# EasyEDA Pro project DemultiplexerLibrary.eprj

# Schematic 1-to-16
Create Date: 2023-07-29; Page Name: P1; Project Name: DemultiplexerLibrary; Schematic Name: 1-to-16; Update Date: 2023-07-29; Company: EasyEDA.com; Drawed: EasyEDA Pro; Page Size: A4; Part Number: JLCPCB-002; Reviewed: EasyEDA Pro; Version: V0.1
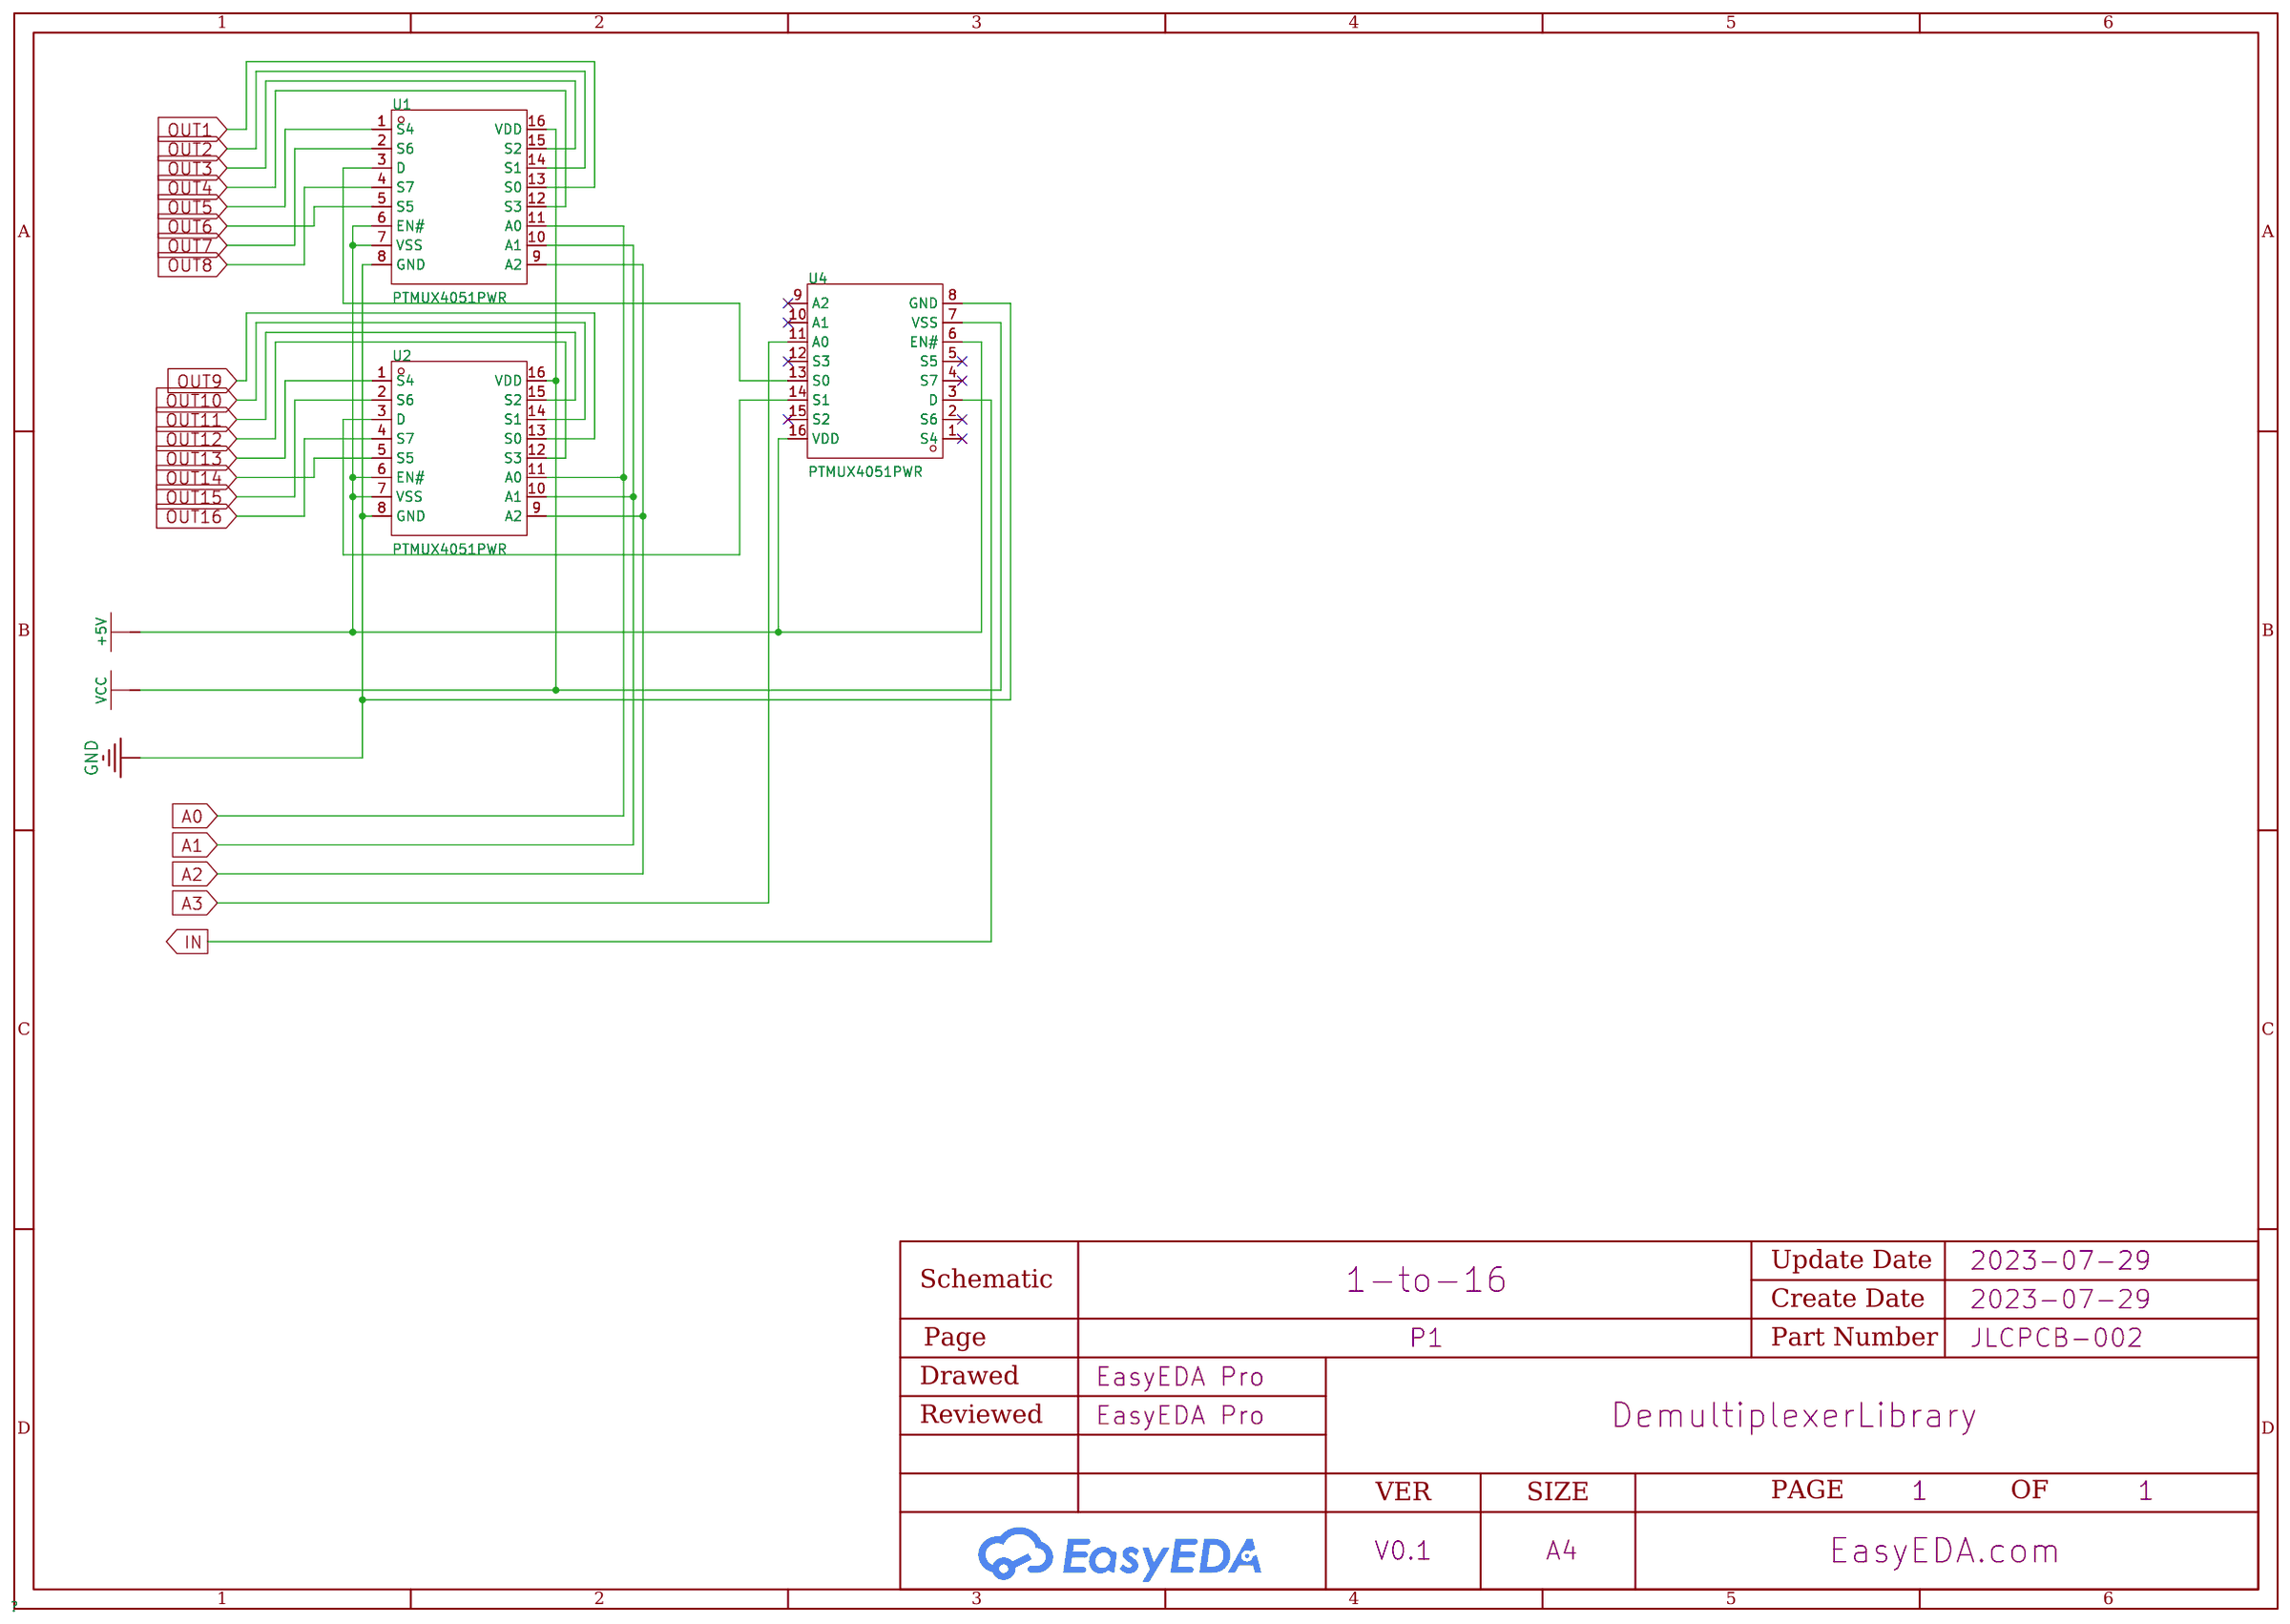
[diagram p0: schematic sheet]

## Parts
U1  PTMUX4051PWR  [TSSOP-16_L5.0-W4.4-P0.65-LS6.4-BL]
U2  PTMUX4051PWR  [TSSOP-16_L5.0-W4.4-P0.65-LS6.4-BL]
U4  PTMUX4051PWR  [TSSOP-16_L5.0-W4.4-P0.65-LS6.4-BL]

## Library data of the parts
U1 U2 U4 = PTMUX4051PWR: Supplier Part: C3033241; Manufacturer: TI(德州仪器); Supplier Footprint: TSSOP(PW); JLCPCB Part Class: Extended Part; Supplier: LCSC

## Nets
+5V: U1.6(EN#) U1.7(VSS) U2.6(EN#) U2.7(VSS) U4.6(EN#) U4.16(VDD)
GND: U1.8(GND) U2.8(GND) U4.8(GND)
VCC: U1.16(VDD) U2.16(VDD) U4.7(VSS)
A0: U1.11(A0) U2.11(A0)
A1: U1.10(A1) U2.10(A1)
A2: U1.9(A2) U2.9(A2)
A3: U4.11(A0)
IN: U4.3(D)
OUT1: U1.13(S0)
OUT2: U1.14(S1)
OUT3: U1.15(S2)
OUT4: U1.12(S3)
OUT5: U1.1(S4)
OUT6: U1.5(S5)
OUT7: U1.2(S6)
OUT8: U1.4(S7)
OUT9: U2.13(S0)
OUT10: U2.14(S1)
OUT11: U2.15(S2)
OUT12: U2.12(S3)
OUT13: U2.1(S4)
OUT14: U2.5(S5)
OUT15: U2.2(S6)
OUT16: U2.4(S7)
Net-(U1-3): U1.3(D) U4.13(S0)
Net-(U2-3): U2.3(D) U4.14(S1)

Not connected (* = marked no-connect by the designer): U4 1(S4)* 2(S6)* 4(S7)* 5(S5)* 9(A2)* 10(A1)* 12(S3)* 15(S2)*

# Schematic 1-to-32
Create Date: 2023-07-29; Page Name: P1; Project Name: DemultiplexerLibrary; Schematic Name: 1-to-32; Update Date: 2023-07-29; Company: EasyEDA.com; Drawed: EasyEDA Pro; Page Size: A4; Part Number: JLCPCB-002; Reviewed: EasyEDA Pro; Version: V0.1
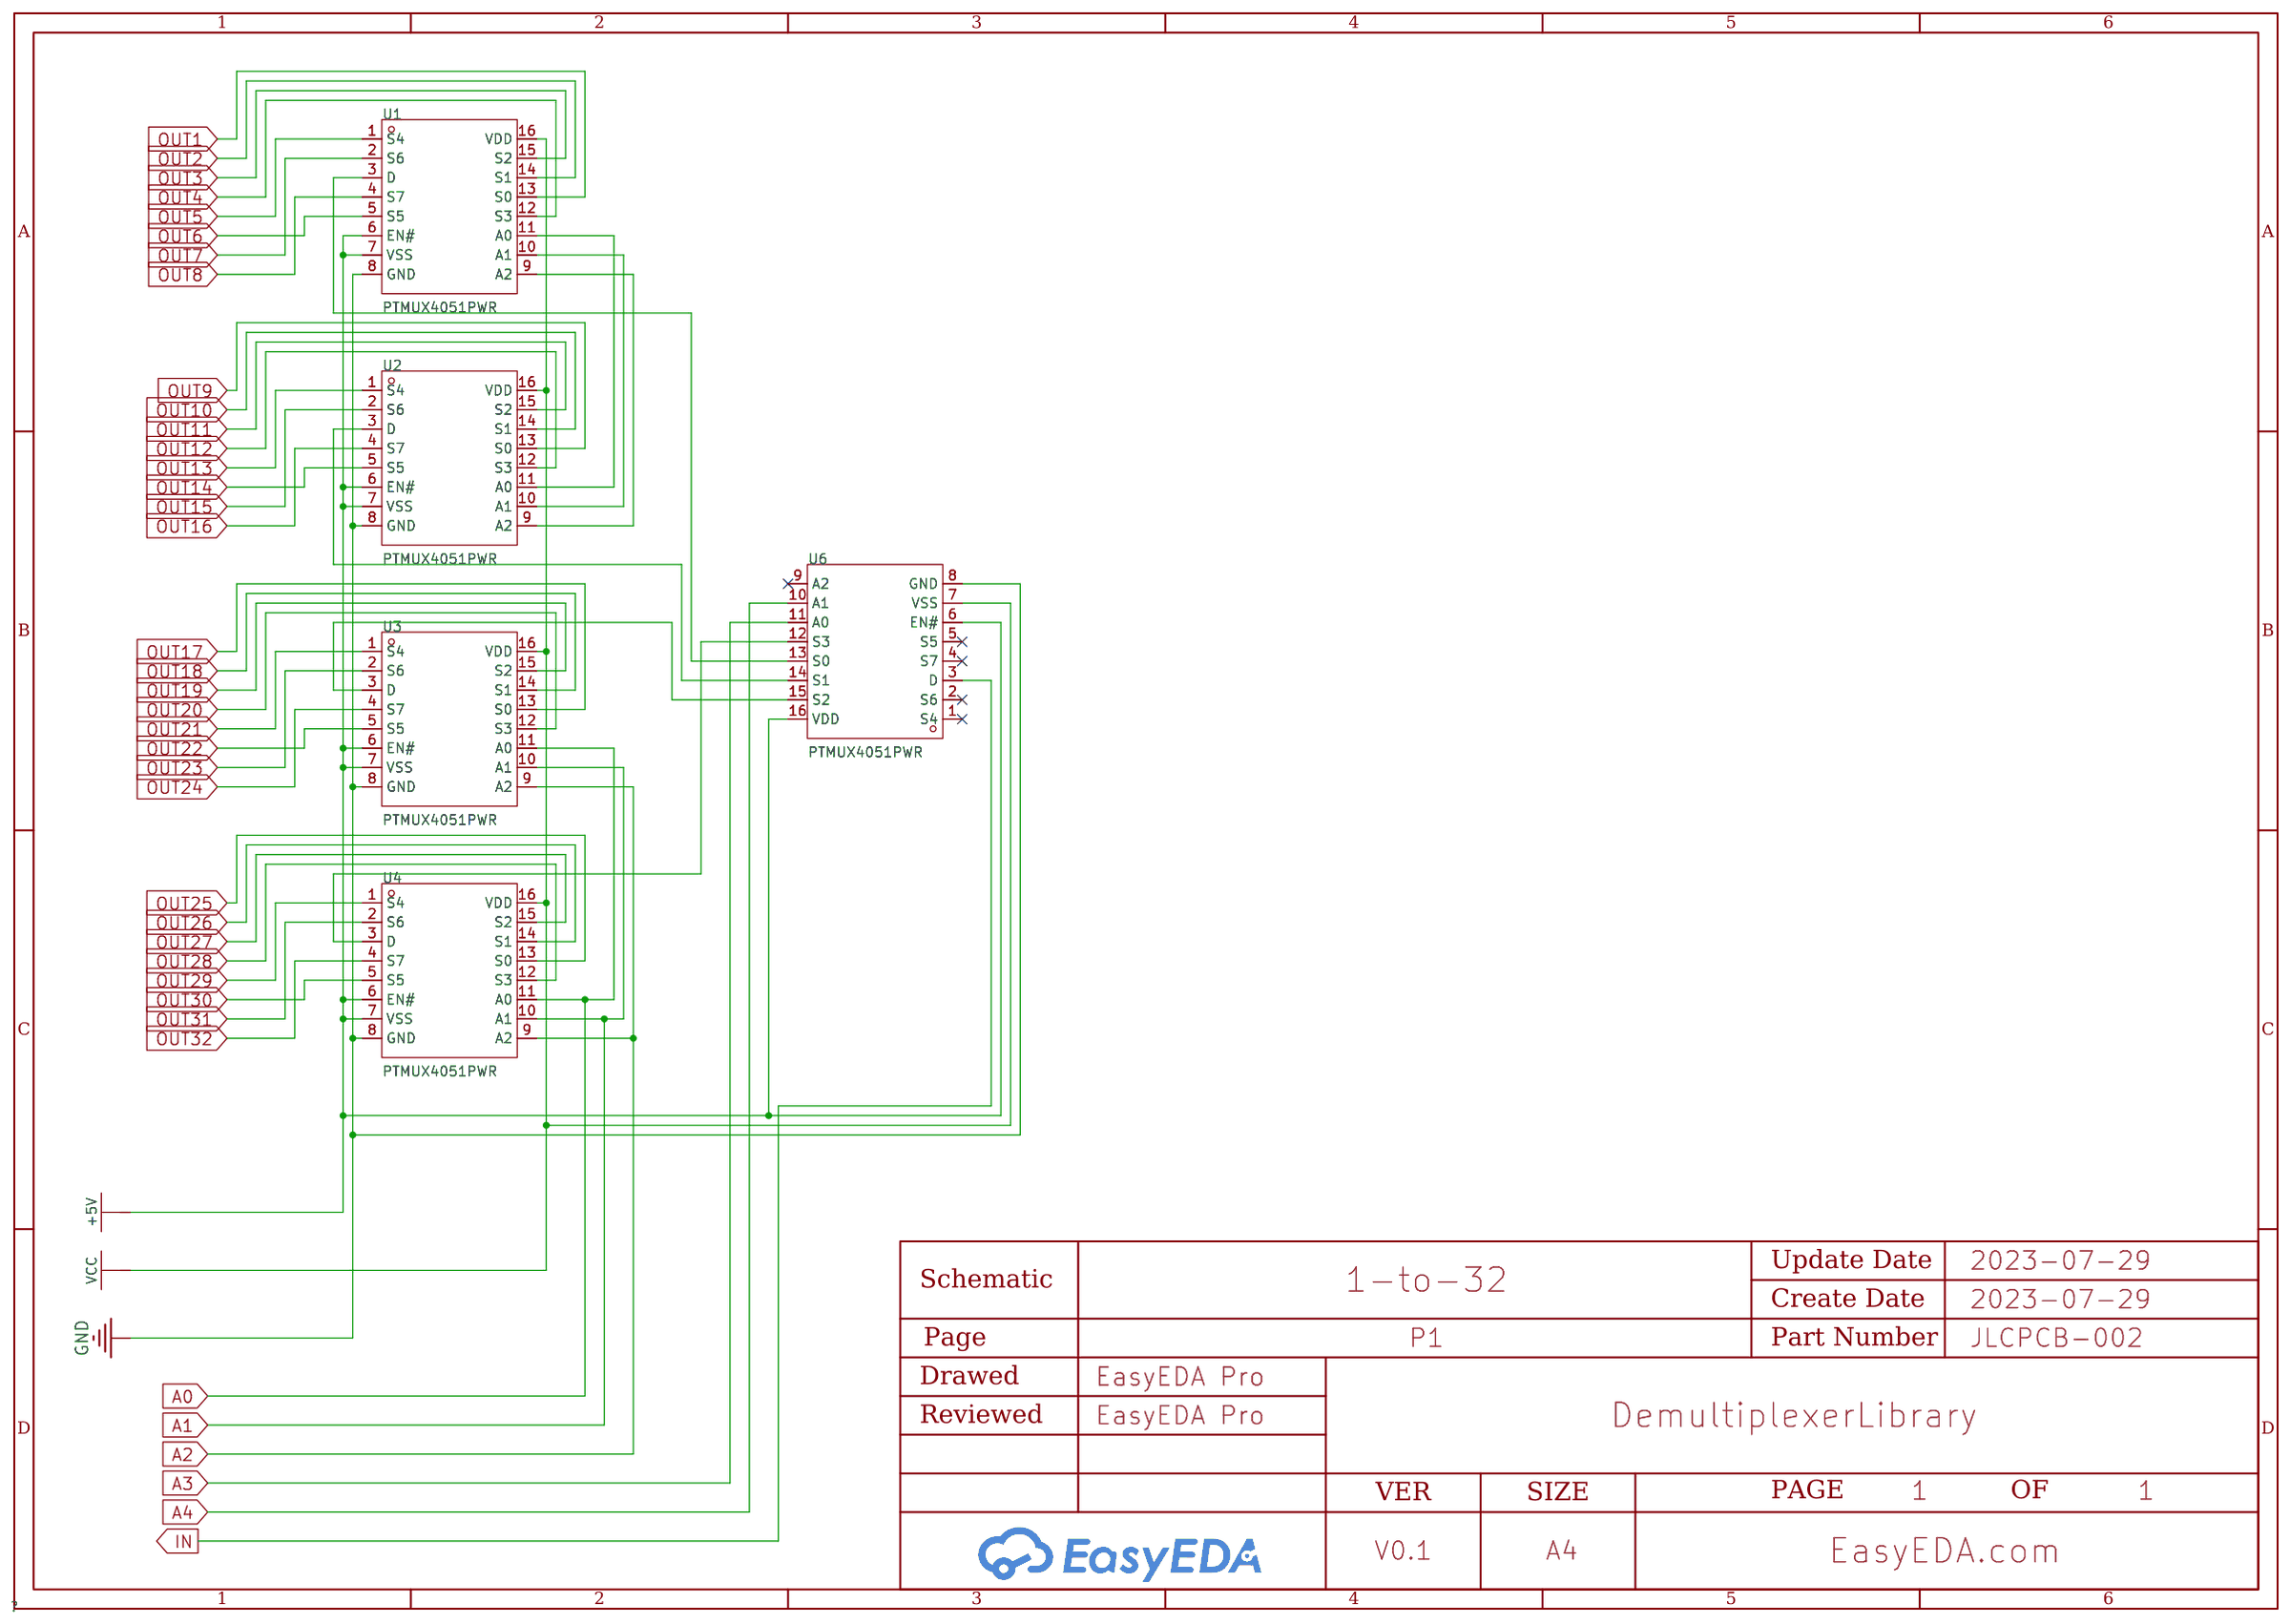
[diagram p1: schematic sheet]

## Parts
U1  PTMUX4051PWR  [TSSOP-16_L5.0-W4.4-P0.65-LS6.4-BL]
U2  PTMUX4051PWR  [TSSOP-16_L5.0-W4.4-P0.65-LS6.4-BL]
U3  PTMUX4051PWR  [TSSOP-16_L5.0-W4.4-P0.65-LS6.4-BL]
U4  PTMUX4051PWR  [TSSOP-16_L5.0-W4.4-P0.65-LS6.4-BL]
U6  PTMUX4051PWR  [TSSOP-16_L5.0-W4.4-P0.65-LS6.4-BL]

## Library data of the parts
U1-U4 U6 = PTMUX4051PWR: Supplier Part: C3033241; Manufacturer: TI(德州仪器); Supplier Footprint: TSSOP(PW); JLCPCB Part Class: Extended Part; Supplier: LCSC

## Nets
+5V: U1.6(EN#) U1.7(VSS) U2.6(EN#) U2.7(VSS) U3.6(EN#) U3.7(VSS) U4.6(EN#) U4.7(VSS) U6.6(EN#) U6.16(VDD)
GND: U1.8(GND) U2.8(GND) U3.8(GND) U4.8(GND) U6.8(GND)
VCC: U1.16(VDD) U2.16(VDD) U3.16(VDD) U4.16(VDD) U6.7(VSS)
A0: U3.11(A0) U4.11(A0)
A1: U3.10(A1) U4.10(A1)
A2: U3.9(A2) U4.9(A2)
A3: U6.11(A0)
A4: U6.10(A1)
IN: U6.3(D)
OUT1: U1.13(S0)
OUT2: U1.14(S1)
OUT3: U1.15(S2)
OUT4: U1.12(S3)
OUT5: U1.1(S4)
OUT6: U1.5(S5)
OUT7: U1.2(S6)
OUT8: U1.4(S7)
OUT9: U2.13(S0)
OUT10: U2.14(S1)
OUT11: U2.15(S2)
OUT12: U2.12(S3)
OUT13: U2.1(S4)
OUT14: U2.5(S5)
OUT15: U2.2(S6)
OUT16: U2.4(S7)
OUT17: U3.13(S0)
OUT18: U3.14(S1)
OUT19: U3.15(S2)
OUT20: U3.12(S3)
OUT21: U3.1(S4)
OUT22: U3.5(S5)
OUT23: U3.2(S6)
OUT24: U3.4(S7)
OUT25: U4.13(S0)
OUT26: U4.14(S1)
OUT27: U4.15(S2)
OUT28: U4.12(S3)
OUT29: U4.1(S4)
OUT30: U4.5(S5)
OUT31: U4.2(S6)
OUT32: U4.4(S7)
Net-(U1-3): U1.3(D) U6.13(S0)
Net-(U1-9): U1.9(A2) U2.9(A2)
Net-(U1-10): U1.10(A1) U2.10(A1)
Net-(U1-11): U1.11(A0) U2.11(A0)
Net-(U2-3): U2.3(D) U6.14(S1)
Net-(U3-3): U3.3(D) U6.15(S2)
Net-(U4-3): U4.3(D) U6.12(S3)

Not connected (* = marked no-connect by the designer): U6 1(S4)* 2(S6)* 4(S7)* 5(S5)* 9(A2)*

# Schematic 1-to-64
Create Date: 2023-07-29; Page Name: P1; Project Name: DemultiplexerLibrary; Schematic Name: 1-to-64; Update Date: 2023-07-29; Company: EasyEDA.com; Drawed: EasyEDA Pro; Page Size: A4; Part Number: JLCPCB-002; Reviewed: EasyEDA Pro; Version: V0.1
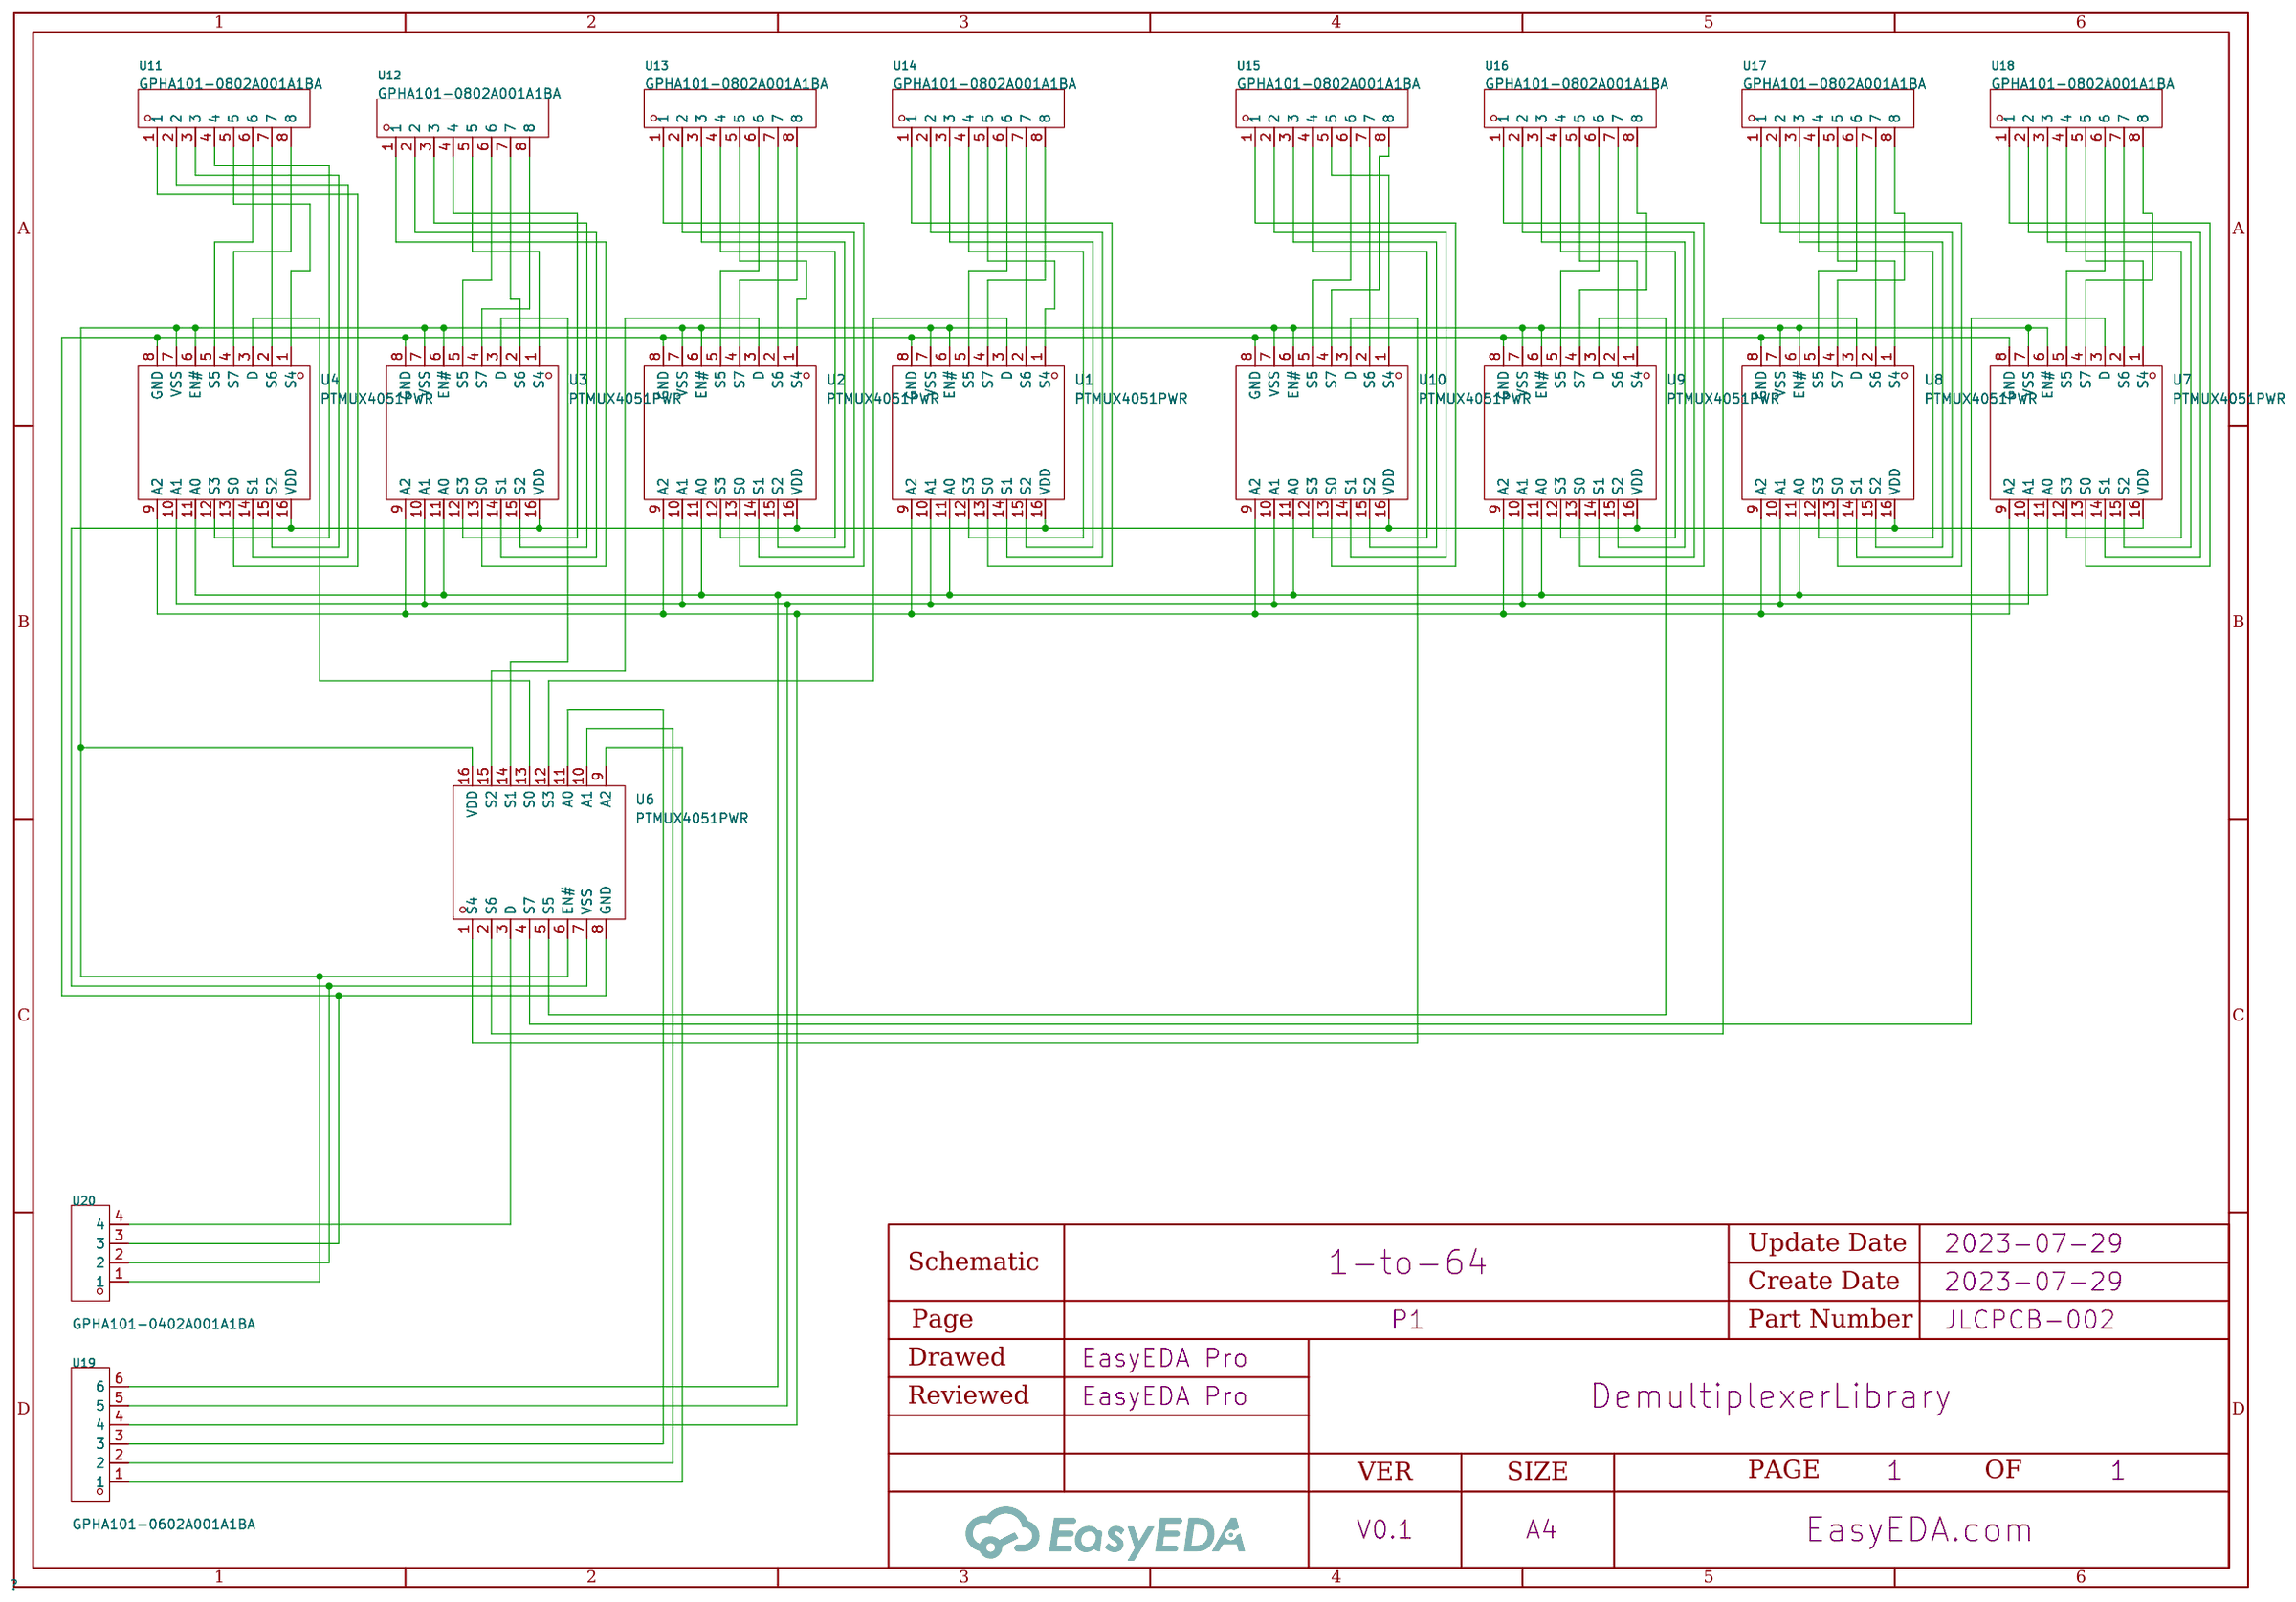
[diagram p2: schematic sheet]

## Parts
U1  PTMUX4051PWR  [TSSOP-16_L5.0-W4.4-P0.65-LS6.4-BL]
U2  PTMUX4051PWR  [TSSOP-16_L5.0-W4.4-P0.65-LS6.4-BL]
U3  PTMUX4051PWR  [TSSOP-16_L5.0-W4.4-P0.65-LS6.4-BL]
U4  PTMUX4051PWR  [TSSOP-16_L5.0-W4.4-P0.65-LS6.4-BL]
U6  PTMUX4051PWR  [TSSOP-16_L5.0-W4.4-P0.65-LS6.4-BL]
U7  PTMUX4051PWR  [TSSOP-16_L5.0-W4.4-P0.65-LS6.4-BL]
U8  PTMUX4051PWR  [TSSOP-16_L5.0-W4.4-P0.65-LS6.4-BL]
U9  PTMUX4051PWR  [TSSOP-16_L5.0-W4.4-P0.65-LS6.4-BL]
U10  PTMUX4051PWR  [TSSOP-16_L5.0-W4.4-P0.65-LS6.4-BL]
U11  GPHA101-0802A001A1BA  [HDR-TH_8P-P2.54-V-M]
U12  GPHA101-0802A001A1BA  [HDR-TH_8P-P2.54-V-M]
U13  GPHA101-0802A001A1BA  [HDR-TH_8P-P2.54-V-M]
U14  GPHA101-0802A001A1BA  [HDR-TH_8P-P2.54-V-M]
U15  GPHA101-0802A001A1BA  [HDR-TH_8P-P2.54-V-M]
U16  GPHA101-0802A001A1BA  [HDR-TH_8P-P2.54-V-M]
U17  GPHA101-0802A001A1BA  [HDR-TH_8P-P2.54-V-M]
U18  GPHA101-0802A001A1BA  [HDR-TH_8P-P2.54-V-M]
U19  GPHA101-0602A001A1BA  [HDR-TH_6P-P2.54-V-M]
U20  GPHA101-0402A001A1BA  [HDR-TH_4P-P2.54-V-M]

## Library data of the parts
U1-U4 U6-U10 = PTMUX4051PWR: Supplier Part: C3033241; Manufacturer: TI(德州仪器); Supplier Footprint: TSSOP(PW); JLCPCB Part Class: Extended Part; Supplier: LCSC
U11-U18 = GPHA101-0802A001A1BA: Supplier Part: C7434484; Manufacturer: GREENCONN(格康); Supplier Footprint: 插件,P=2.54mm; Datasheet: https://atta.szlcsc.com/upload/public/pdf/source/20230629/29B861B43DC477A011ED023B9618EA31.pdf; Supplier: LCSC
U19 = GPHA101-0602A001A1BA: Supplier Part: C7434490; Manufacturer: GREENCONN(格康); Supplier Footprint: 插件,P=2.54mm; Datasheet: https://atta.szlcsc.com/upload/public/pdf/source/20230629/29B861B43DC477A011ED023B9618EA31.pdf; Supplier: LCSC
U20 = GPHA101-0402A001A1BA: Supplier Part: C7434478; Manufacturer: GREENCONN(格康); Supplier Footprint: 插件,P=2.54mm; Datasheet: https://atta.szlcsc.com/upload/public/pdf/source/20230629/29B861B43DC477A011ED023B9618EA31.pdf; Supplier: LCSC

## Nets
$1N1038: U1.16(VDD) U2.16(VDD) U3.16(VDD) U4.16(VDD) U6.7(VSS) U7.16(VDD) U8.16(VDD) U9.16(VDD) U10.16(VDD) U20.2
$1N1040: U1.8(GND) U2.8(GND) U3.8(GND) U4.8(GND) U6.8(GND) U7.8(GND) U8.8(GND) U9.8(GND) U10.8(GND) U20.3
$1N1042: U1.6(EN#) U1.7(VSS) U2.6(EN#) U2.7(VSS) U3.6(EN#) U3.7(VSS) U4.6(EN#) U4.7(VSS) U6.6(EN#) U6.16(VDD) U7.6(EN#) U7.7(VSS) U8.6(EN#) U8.7(VSS) U9.6(EN#) U9.7(VSS) U10.6(EN#) U10.7(VSS) U20.1
$1N1045: U1.9(A2) U2.9(A2) U3.9(A2) U4.9(A2) U7.9(A2) U8.9(A2) U9.9(A2) U10.9(A2) U19.4
$1N1046: U6.10(A1) U19.2
$1N1048: U1.11(A0) U2.11(A0) U3.11(A0) U4.11(A0) U7.11(A0) U8.11(A0) U9.11(A0) U10.11(A0) U19.6
$1N1057: U1.10(A1) U2.10(A1) U3.10(A1) U4.10(A1) U7.10(A1) U8.10(A1) U9.10(A1) U10.10(A1) U19.5
$1N1058: U6.3(D) U20.4
$1N1060: U6.11(A0) U19.3
$1N1964: U6.9(A2) U19.1
$1N3021: U4.3(D) U6.13(S0)
$1N3028: U3.3(D) U6.14(S1)
$1N3037: U2.3(D) U6.15(S2)
$1N3048: U1.3(D) U6.12(S3)
$1N3058: U6.1(S4) U10.3(D)
$1N3068: U6.5(S5) U9.3(D)
$1N3079: U6.2(S6) U8.3(D)
$1N3215: U6.4(S7) U7.3(D)
$1N3881: U4.13(S0) U11.1
$1N3886: U4.14(S1) U11.2
$1N3891: U4.15(S2) U11.3
$1N3896: U4.12(S3) U11.4
$1N3906: U4.5(S5) U11.6
$1N3911: U4.2(S6) U11.7
$1N3914: U4.1(S4) U11.5
$1N3928: U4.4(S7) U11.8
$1N3949: U3.13(S0) U12.1
$1N3954: U3.14(S1) U12.2
$1N3965: U3.15(S2) U12.3
$1N3970: U3.12(S3) U12.4
$1N3975: U3.1(S4) U12.5
$1N3980: U3.5(S5) U12.6
$1N3985: U3.2(S6) U12.7
$1N3996: U3.4(S7) U12.8
$1N4043: U2.13(S0) U13.1
$1N4047: U2.14(S1) U13.2
$1N4051: U2.15(S2) U13.3
$1N4055: U2.12(S3) U13.4
$1N4059: U2.1(S4) U13.5
$1N4064: U2.5(S5) U13.6
$1N4078: U2.2(S6) U13.7
$1N4086: U2.4(S7) U13.8
$1N4111: U1.13(S0) U14.1
$1N4115: U1.14(S1) U14.2
$1N4119: U1.15(S2) U14.3
$1N4123: U1.12(S3) U14.4
$1N4127: U1.1(S4) U14.5
$1N4132: U1.5(S5) U14.6
$1N4137: U1.2(S6) U14.7
$1N4145: U1.4(S7) U14.8
$1N4177: U10.13(S0) U15.1
$1N4181: U10.14(S1) U15.2
$1N4185: U10.15(S2) U15.3
$1N4189: U10.12(S3) U15.4
$1N4193: U10.1(S4) U15.5
$1N4204: U10.5(S5) U15.6
$1N4225: U10.2(S6) U15.7
$1N4228: U10.4(S7) U15.8
$1N4281: U9.13(S0) U16.1
$1N4285: U9.14(S1) U16.2
$1N4289: U9.15(S2) U16.3
$1N4293: U9.12(S3) U16.4
$1N4297: U9.1(S4) U16.5
$1N4302: U9.5(S5) U16.6
$1N4307: U9.2(S6) U16.7
$1N4310: U9.4(S7) U16.8
$1N4317: U8.13(S0) U17.1
$1N4321: U8.14(S1) U17.2
$1N4325: U8.15(S2) U17.3
$1N4333: U7.13(S0) U18.1
$1N4337: U7.14(S1) U18.2
$1N4341: U7.15(S2) U18.3
$1N4345: U7.12(S3) U18.4
$1N4349: U8.1(S4) U17.5
$1N4373: U8.5(S5) U17.6
$1N4379: U8.2(S6) U17.7
$1N4380: U8.12(S3) U17.4
$1N4389: U8.4(S7) U17.8
$1N4396: U7.1(S4) U18.5
$1N4401: U7.5(S5) U18.6
$1N4406: U7.2(S6) U18.7
$1N4409: U7.4(S7) U18.8

# Board 1-to-64-demux
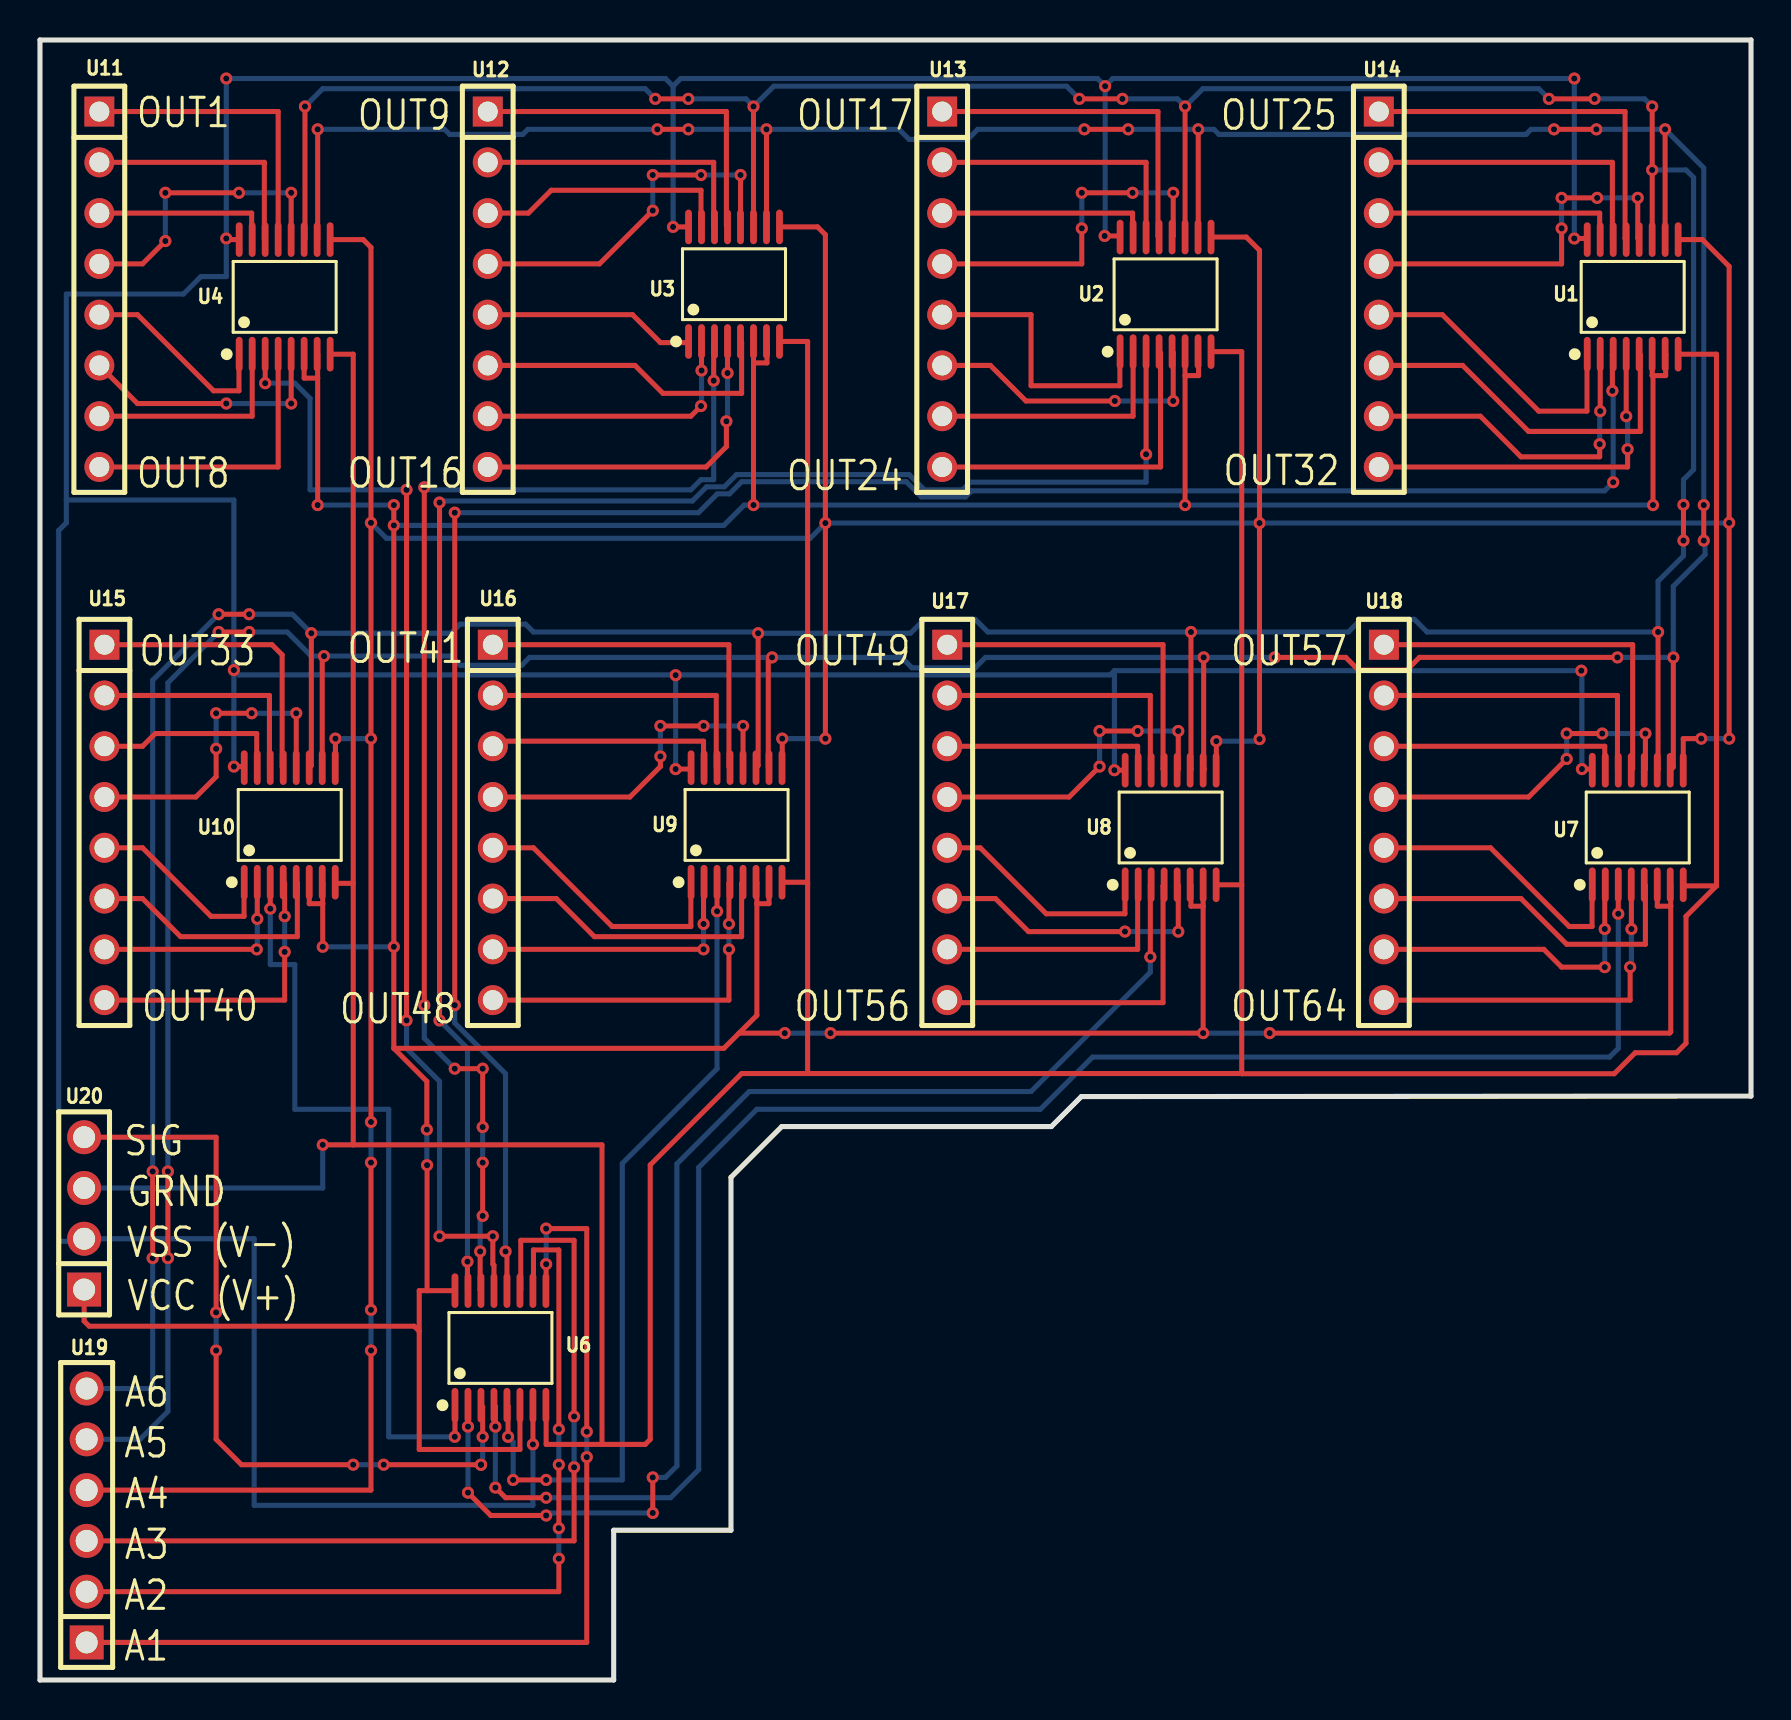
[diagram p3: board, top side]
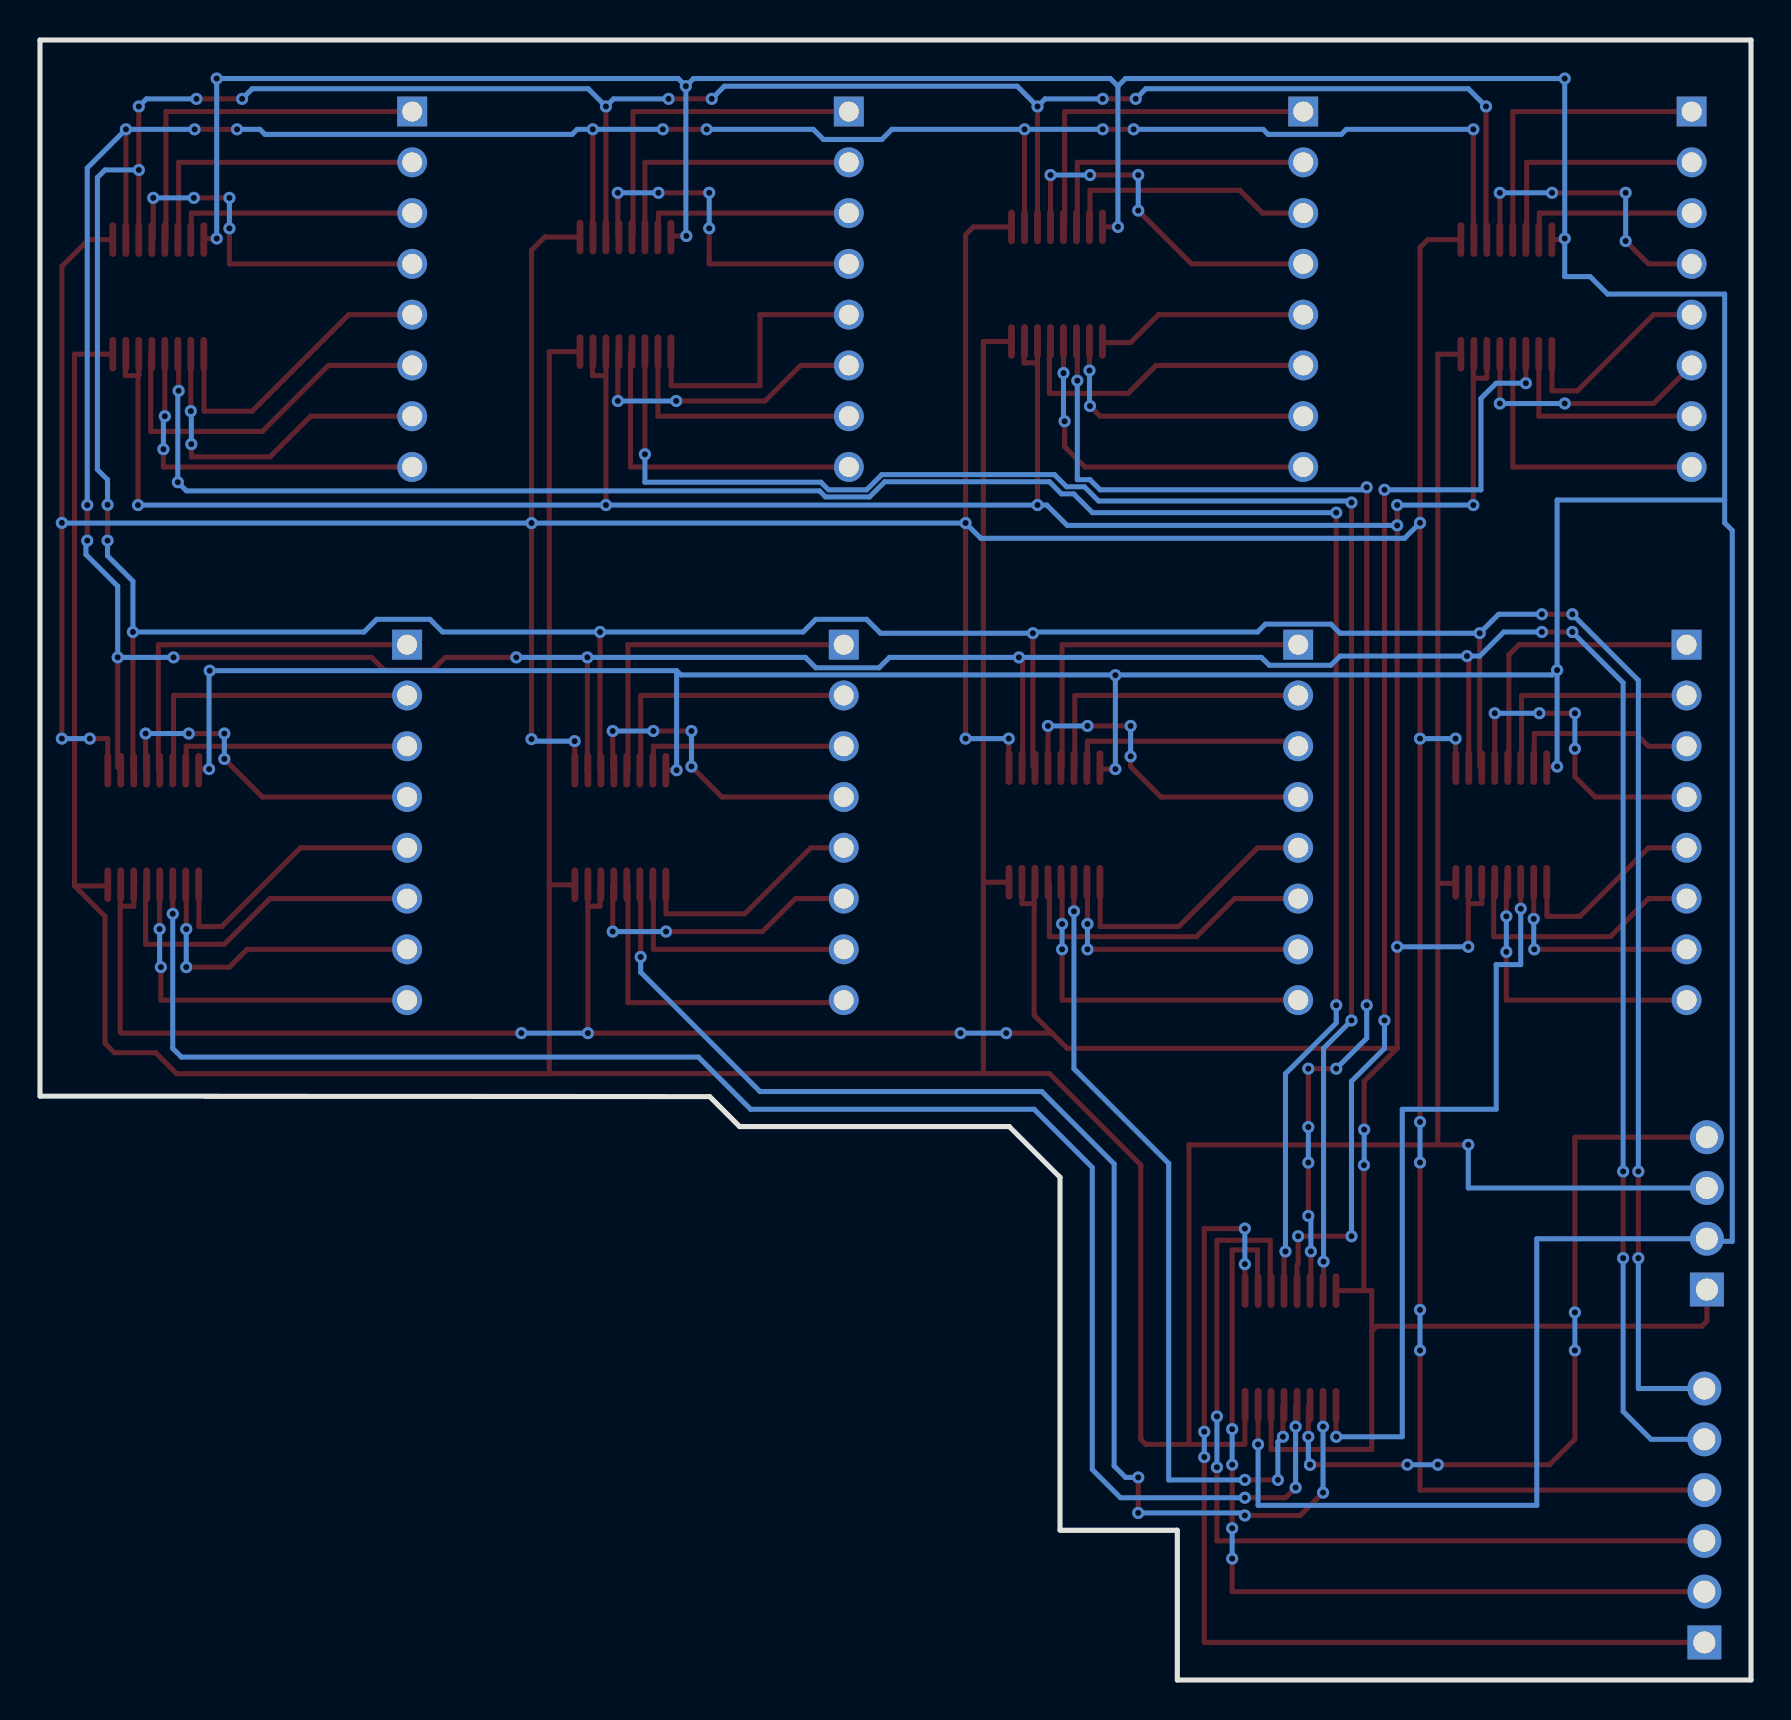
[diagram p4: board, bottom side, seen from below]

Outline 85.6 x 82.04 mm; copper layers: Top Layer, Bottom Layer. Coordinates in mm from the lower left corner of the outline.
Outline path: 0,82.04 0,0 28.7,0 28.7,7.49 34.57,7.49 34.57,25.15 37.11,27.69 50.59,27.69 52.09,29.18 85.6,29.21 85.6,82.04 0,82.04
Stack: Top Layer 0.035mm / Dielectric1 1.51mm FR4 er 4.5 / Bottom Layer 0.035mm

## Design rules (mm)
template: JLCPCB Capability(Two Layers Board)
spacing copperThickness1oz (default): track to track 0.102, other pairs 0.152 to 0.3
spacing copperThickness2oz: track to track 0.203, other pairs 0.152 to 0.3
track width copperThickness1oz (default): min 0.127, default 0.254, max 2.54
track width copperThickness2oz: min 0.203, default 0.254, max 2.54
differential pair differentialPair (default): width min 0.127, default 0.254, max 2.54; gap min 0.152, default 0.152
via viaSize (default): diameter min 0.5, default 0.61, max 10; hole min 0.3, default 0.305, max 6.3

## Placement (name value [footprint] x y rotation side)
U1  PTMUX4051PWR  [TSSOP-16_L5.0-W4.4-P0.65-LS6.4-BL]  79.68 69.19 0 top
U2  PTMUX4051PWR  [TSSOP-16_L5.0-W4.4-P0.65-LS6.4-BL]  56.31 69.32 0 top
U3  PTMUX4051PWR  [TSSOP-16_L5.0-W4.4-P0.65-LS6.4-BL]  34.72 69.83 0 top
U4  PTMUX4051PWR  [TSSOP-16_L5.0-W4.4-P0.65-LS6.4-BL]  12.24 69.19 0 top
U6  PTMUX4051PWR  [TSSOP-16_L5.0-W4.4-P0.65-LS6.4-BL]  23.04 16.61 0 top
U7  PTMUX4051PWR  [TSSOP-16_L5.0-W4.4-P0.65-LS6.4-BL]  79.93 42.65 0 top
U8  PTMUX4051PWR  [TSSOP-16_L5.0-W4.4-P0.65-LS6.4-BL]  56.56 42.65 0 top
U9  PTMUX4051PWR  [TSSOP-16_L5.0-W4.4-P0.65-LS6.4-BL]  34.85 42.77 0 top
U10  PTMUX4051PWR  [TSSOP-16_L5.0-W4.4-P0.65-LS6.4-BL]  12.5 42.77 0 top
U11  GPHA101-0802A001A1BA  [HDR-TH_8P-P2.54-V-M]  2.97 69.57 270 top
U12  GPHA101-0802A001A1BA  [HDR-TH_8P-P2.54-V-M]  22.4 69.57 270 top
U13  GPHA101-0802A001A1BA  [HDR-TH_8P-P2.54-V-M]  45.13 69.57 270 top
U14  GPHA101-0802A001A1BA  [HDR-TH_8P-P2.54-V-M]  66.98 69.57 270 top
U15  GPHA101-0802A001A1BA  [HDR-TH_8P-P2.54-V-M]  3.22 42.9 270 top
U16  GPHA101-0802A001A1BA  [HDR-TH_8P-P2.54-V-M]  22.65 42.9 270 top
U17  GPHA101-0802A001A1BA  [HDR-TH_8P-P2.54-V-M]  45.39 42.9 270 top
U18  GPHA101-0802A001A1BA  [HDR-TH_8P-P2.54-V-M]  67.23 42.9 270 top
U19  GPHA101-0602A001A1BA  [HDR-TH_6P-P2.54-V-M]  2.33 8.23 90 top
U20  GPHA101-0402A001A1BA  [HDR-TH_4P-P2.54-V-M]  2.21 23.34 90 top

## Footprints (pads in the part's own frame, mm; a bottom-side part is the same pattern mirrored in y, then rotated)
HDR-TH_4P-P2.54-V-M
  rect 1.7x1.7 hole 1.1: 1(-3.81,0)
  round 1.7 hole 1.1: 2(-1.27,0) 3(1.27,0) 4(3.81,0)
HDR-TH_6P-P2.54-V-M
  rect 1.7x1.7 hole 1.1: 1(-6.35,0)
  round 1.7 hole 1.1: 2(-3.81,0) 3(-1.27,0) 4(1.27,0) 5(3.81,0) 6(6.35,0)
HDR-TH_8P-P2.54-V-M
  rect 1.5x1.5 hole 1: 1(-8.89,0)
  round 1.5 hole 1: 2(-6.35,0) 3(-3.81,0) 4(-1.27,0) 5(1.27,0) 6(3.81,0) 7(6.35,0) 8(8.89,0)
TSSOP-16_L5.0-W4.4-P0.65-LS6.4-BL
  oval 0.343x1.732 smd: 1(-2.275,-2.866) 2(-1.625,-2.866) 3(-0.975,-2.866) 4(-0.325,-2.866) 5(0.325,-2.866) 6(0.975,-2.866) 7(1.625,-2.866) 8(2.275,-2.866) 9(2.275,2.866) 10(1.625,2.866) 11(0.975,2.866) 12(0.325,2.866) 13(-0.325,2.866) 14(-0.975,2.866) 15(-1.625,2.866) 16(-2.275,2.866)

## Nets
As in the schematic.

## Via types
v1: diameter 0.61, hole 0.305, Top Layer to Bottom Layer, 203 vias

## Routing (per net, layer and track width the routed paths; a pad name or vN(x,y) marks a point on that pad's centre or on a via; arc(x,y) is an arc through that point)
$1N1038: length 307.8
  Top Layer w0.254: U1.16 77.35,72.11 v1(76.76,72.11) ; v1(9.32,72.11) 9.38,72.06 U4.16 ; U7.16 77.6,45.57 v1(77.14,45.57) ; v1(9.7,45.7) 10.16,45.7 U10.16 ; v1(53.75,45.51) U8.16 ; U3.16 v1(31.67,72.69) ; U9.16 32.5,45.57 v1(31.8,45.57) ; 54.04,72.18 53.98,72.24 v1(53.26,72.24) ; v1(24.66,11.79) U6.7
  Bottom Layer w0.254: v1(77.14,45.57) 77.14,50.46 v1(77.11,50.49) 53.75,50.49 ; 1.32,59.03 1.32,57.89 0.94,57.51 0.94,21.95 2.08,21.95 2.21,22.07 10.72,22.07 10.72,8.74 24.66,8.74 v1(24.66,11.79) ; 1.32,59.03 9.7,59.03 v1(9.7,50.52) ; 1.32,59.03 1.32,69.33 7.17,69.33 8.05,70.21 9.32,70.21 v1(9.32,80.11) 31.29,80.11 31.67,79.73 ; 31.67,79.73 32.05,80.11 52.91,80.11 v1(53.29,79.73) ; 31.67,79.73 v1(31.67,72.69) ; v1(9.7,50.52) 9.94,50.28 31.79,50.28 v1(31.8,50.27) ; v1(9.7,50.52) v1(9.7,45.7) ; v1(31.8,50.27) v1(31.8,45.57) ; v1(31.8,50.27) 31.81,50.28 53.54,50.28 53.75,50.49 ; 53.75,50.49 v1(53.75,45.51) ; v1(53.29,79.73) 53.29,72.26 v1(53.26,72.24) ; v1(53.29,79.73) 53.67,80.11 v1(76.76,80.11) v1(76.76,72.11)
$1N1040: length 277
  Top Layer w0.254: U6.8 25.32,13.74 25.32,11.79 28.12,11.79 ; 15.67,39.85 15.67,66.32 U4.8 ; 15.67,39.85 14.83,39.85 U10.8 ; 15.67,39.85 15.67,26.77 ; 38.4,39.85 38.35,39.91 U9.8 ; 38.4,39.85 38.4,30.34 ; 38.4,39.85 38.4,66.96 U3.8 ; 83.87,39.73 82.26,39.73 U7.8 ; 83.87,39.73 83.87,66.32 81.95,66.32 ; 83.87,39.73 82.34,38.2 82.34,31.85 81.87,31.38 79.8,31.38 78.75,30.33 60.13,30.33 60.12,30.34 ; 60.12,30.34 38.4,30.34 ; 60.12,30.34 60.12,39.77 ; U2.8 60.12,66.45 60.12,39.77 ; 28.12,11.79 28.12,26.77 15.67,26.77 ; 28.12,11.79 30.27,11.79 30.53,12.04 30.53,25.77 35.1,30.34 38.4,30.34 ; U8.8 60.11,39.78 60.12,39.77 ; 15.67,26.77 v1(14.15,26.77)
  Bottom Layer w0.254: U20.3 14.15,24.61 v1(14.15,26.77)
$1N1042: length 281.6
  Top Layer w0.254: 18.97,17.45 18.97,11.53 24.01,11.53 24.01,13.75 ; 18.97,17.45 18.72,17.7 2.46,17.7 2.21,17.95 U20.1 ; 18.97,17.45 18.97,19.48 19.36,19.48 ; 14.15,38.84 14.15,39.88 U10.7 ; 14.15,38.84 13.47,38.84 U10.6 ; 14.15,38.84 v1(14.15,36.68) ; 58.19,38.71 57.58,38.71 57.58,39.74 U8.6 ; 58.19,38.71 U8.7 ; 58.19,38.71 v1(58.19,32.36) v1(39.55,32.36) ; U9.7 36.47,38.84 35.86,38.84 ; 81.58,38.71 81.58,32.42 81.53,32.36 v1(61.52,32.36) ; 81.58,38.71 80.91,38.71 U7.6 ; 81.58,38.71 81.58,39.76 U7.7 ; U1.6 80.65,65.25 ; 80.65,65.25 81.33,65.25 81.33,66.3 U1.7 ; 80.65,65.25 80.69,65.21 v1(80.69,58.78) ; 17.7,31.6 v1(17.7,36.68) v1(17.7,57.76) v1(17.7,58.78) ; 17.7,31.6 34.21,31.6 34.97,32.36 ; 17.7,31.6 19.35,29.95 v1(19.35,27.53) ; 35.86,38.84 35.86,39.87 U9.6 ; 35.86,38.84 35.86,33.25 34.97,32.36 ; 57.29,65.25 v1(57.29,58.78) ; 57.29,65.25 57.96,65.25 57.96,66.43 U2.7 ; 57.29,65.25 U2.6 ; U6.16 19.36,19.48 ; 19.36,19.48 v1(19.36,25.76) ; 34.97,32.36 v1(37.26,32.36) ; U4.6 13.22,65.13 13.89,65.13 ; U4.7 13.89,66.3 13.89,65.13 ; 13.89,65.13 v1(13.89,58.78) ; U3.7 36.37,66.93 36.37,65.89 35.7,65.89 ; 35.7,66.96 35.7,65.89 ; 35.7,65.89 v1(35.7,58.78)
  Bottom Layer w0.254: v1(19.35,27.53) 19.35,25.77 v1(19.36,25.76) ; v1(13.89,58.78) v1(17.7,58.78) ; v1(17.7,36.68) 17.7,36.68 v1(14.15,36.68) ; v1(80.69,58.78) v1(57.29,58.78) v1(35.7,58.78) 35.23,58.78 34.21,57.76 v1(17.7,57.76) ; v1(58.19,32.36) v1(61.52,32.36) ; v1(39.55,32.36) v1(37.26,32.36)
$1N1045: length 243.1
  Top Layer w0.254: v1(84.5,47.09) v1(84.5,57.89) 84.5,70.71 83.16,72.06 81.95,72.06 ; v1(14.78,47.09) 14.78,45.65 U10.9 ; v1(83.11,47.09) 82.21,47.09 U7.9 ; v1(37.13,47.09) 37.13,45.65 U9.9 ; v1(16.56,16.49) 16.56,9.5 U19.4 ; U3.9 38.9,72.69 39.29,72.3 v1(39.29,57.88) v1(39.29,47.09) ; v1(58.85,46.97) 58.85,45.52 U8.9 ; v1(61.01,47.07) 61.01,71.52 60.35,72.18 U2.9 ; U4.9 16.17,72.06 16.56,71.66 v1(16.56,57.89) v1(16.56,27.92) ; v1(16.56,25.88) v1(16.56,18.52)
  Bottom Layer w0.254: v1(84.5,47.09) v1(83.11,47.09) ; v1(39.29,57.88) v1(61.01,57.88) 84.49,57.88 v1(84.5,57.89) ; v1(39.29,57.88) 38.53,57.11 17.33,57.11 v1(16.56,57.89) ; v1(39.29,57.88) 39.29,57.89 ; v1(61.01,47.07) 60.91,46.97 v1(58.85,46.97) ; v1(14.78,47.09) v1(16.56,47.09) ; v1(37.13,47.09) v1(39.29,47.09) ; v1(16.56,25.88) v1(16.56,27.92) ; v1(16.56,16.49) v1(16.56,18.52)
$1N1046: length 44
  Top Layer w0.254: v1(25.96,6.07) 25.96,4.42 U19.2 ; v1(25.96,12.55) 25.96,21.51 24.69,21.51 24.69,19.5 U6.10 ; v1(25.96,10.77) v1(25.96,7.6)
  Bottom Layer w0.254: v1(25.96,10.77) v1(25.96,12.55) ; v1(25.96,7.6) v1(25.96,6.07)
$1N1048: length 265.6
  Top Layer w0.254: v1(57.58,52.43) 57.58,45.6 57.6,45.58 ; 35.89,45.71 35.93,45.75 v1(35.93,52.36) ; v1(51.99,79.1) v1(54.15,79.1) ; U4.11 13.26,72.1 v1(13.26,78.72) ; v1(8.94,53.32) v1(10.46,53.32) ; v1(80.65,78.72) U1.11 ; v1(5.64,25.44) v1(5.64,21.1) ; 13.53,45.71 13.57,45.75 v1(13.57,52.36) ; v1(30.78,79.1) v1(32.43,79.1) ; v1(77.77,79.1) v1(75.49,79.1) ; v1(80.95,52.43) 80.95,45.6 80.97,45.58 ; 35.7,72.69 v1(35.7,78.72) ; v1(82.22,57) v1(82.22,58.79) ; U2.11 v1(57.29,78.72)
  Bottom Layer w0.254: v1(13.26,78.72) 14.15,79.6 30.27,79.6 v1(30.78,79.1) ; v1(51.99,79.1) 51.36,79.73 36.71,79.73 v1(35.7,78.72) 35.31,79.1 v1(32.43,79.1) ; v1(5.64,21.1) 5.64,14.58 U19.6 ; v1(5.64,25.44) 5.64,50.01 v1(8.94,53.32) ; v1(80.65,78.72) 80.27,79.1 v1(77.77,79.1) ; v1(82.22,57) 82.22,56.24 80.95,54.97 v1(80.95,52.43) 69.39,52.43 68.76,53.06 66.09,53.06 65.45,52.43 47.42,52.43 46.79,53.06 44.24,53.06 43.55,52.36 v1(35.93,52.36) 35.86,52.43 24.69,52.43 24.29,52.82 21.02,52.82 20.56,52.36 v1(13.57,52.36) 12.62,53.32 v1(10.46,53.32) ; v1(75.49,79.1) 74.98,79.6 58.17,79.6 v1(57.29,78.72) 56.9,79.1 v1(54.15,79.1) ; v1(82.22,58.79) 82.22,60.05 82.73,60.55 82.73,75.16 82.34,75.54 80.65,75.54
  vias: v1(80.65,75.54)
$1N1057: length 259.2
  Top Layer w0.254: U1.10 81.3,72.06 v1(81.3,77.57) ; v1(57.94,77.57) 57.94,72.19 U2.10 ; U10.10 14.12,51.13 v1(14.21,51.22) ; v1(36.62,51.16) 36.43,50.97 36.43,45.6 ; v1(30.89,77.57) v1(32.43,77.57) ; U3.10 v1(36.34,77.57) ; v1(81.71,51.16) 81.71,45.67 81.62,45.58 ; 58.25,45.58 58.21,45.62 v1(58.21,51.16) ; v1(83.23,58.78) v1(83.23,57) ; v1(75.74,77.57) v1(77.86,77.57) ; v1(6.4,25.44) v1(6.4,21.1) ; v1(8.94,52.43) v1(10.46,52.43) ; U4.10 13.89,72.08 v1(13.89,77.57) ; v1(52.25,77.57) v1(54.44,77.57) ; v1(78.92,51.16) 69.01,51.16 68.37,50.52 65.96,50.52 65.33,51.16 v1(61.77,51.16)
  Bottom Layer w0.254: v1(8.94,52.43) 6.4,49.89 v1(6.4,25.44) ; v1(6.4,21.1) 6.4,13.44 5,12.04 U19.5 ; v1(30.89,77.57) 24.41,77.57 24.16,77.32 20.5,77.32 20.24,77.57 v1(13.89,77.57) ; v1(83.23,58.78) 83.23,75.64 v1(81.3,77.57) v1(77.86,77.57) ; 46.79,50.64 47.31,51.16 v1(61.77,51.16) ; v1(75.74,77.57) 74.6,77.57 74.34,77.32 58.98,77.32 58.72,77.57 v1(54.44,77.57) ; v1(10.46,52.43) 12.37,52.43 13.57,51.22 v1(14.21,51.22) 20.56,51.22 21.02,50.76 24.1,50.76 24.49,51.16 43.1,51.16 43.62,50.64 46.79,50.64 ; v1(52.25,77.57) 46.91,77.57 46.4,77.06 43.48,77.06 42.98,77.57 v1(32.43,77.57) ; v1(83.23,57) 83.3,56.93 83.3,56.3 81.71,54.71 v1(81.71,51.16) v1(78.92,51.16)
$1N1058: length 38.5
  Top Layer w0.254: v1(15.67,10.77) 10.08,10.77 8.81,12.04 v1(8.81,16.49) ; U6.3 22.15,13.66 v1(22.15,12.17) ; 2.21,27.15 8.81,27.15 v1(8.81,18.39) ; v1(17.19,10.77) v1(22.06,10.77)
  Bottom Layer w0.254: v1(17.19,10.77) v1(15.67,10.77) ; v1(22.06,10.77) 22.15,10.86 v1(22.15,12.17) ; v1(8.81,16.49) v1(8.81,18.39)
$1N1060: length 44.6
  Top Layer w0.254: v1(26.72,13.18) 26.72,22 24.05,22 24.05,19.52 24.01,19.48 ; U19.3 26.72,6.96 v1(26.72,10.64)
  Bottom Layer w0.254: v1(26.72,10.64) v1(26.72,13.18)
$1N1964: length 50.9
  Top Layer w0.254: v1(27.35,11.15) 27.35,1.88 U19.1 ; v1(25.32,20.8) 25.32,19.49 U6.9 ; v1(25.32,22.58) 27.35,22.58 v1(27.35,12.42)
  Bottom Layer w0.254: v1(27.35,11.15) v1(27.35,12.42) ; v1(25.32,22.58) v1(25.32,20.8)
$1N3021: length 56.8
  Top Layer w0.254: v1(18.34,59.54) v1(18.34,33) ; U4.3 v1(11.27,64.87) ; v1(19.99,22.2) v1(22.65,22.2) 22.65,20.8 22.71,20.75 U6.13
  Bottom Layer w0.254: v1(19.99,22.2) 19.99,29.95 18.34,31.6 v1(18.34,33) ; v1(18.34,59.54) 13.51,59.54 13.51,64.11 12.75,64.87 v1(11.27,64.87)
$1N3028: length 64
  Top Layer w0.254: v1(19.23,33.76) v1(19.23,59.67) ; v1(33.7,65) 33.7,66.92 U3.3 ; v1(22.02,21.44) 22.02,19.52 U6.14 ; v1(22.15,25.88) v1(22.15,23.22) ; v1(20.75,30.58) v1(22.15,30.58) v1(22.15,27.66)
  Bottom Layer w0.254: v1(19.23,59.67) 19.35,59.54 32.56,59.54 33.07,60.05 33.7,60.05 v1(33.7,65) ; v1(22.02,21.44) 22.02,23.09 v1(22.15,23.22) ; v1(22.15,27.66) v1(22.15,25.88) ; v1(20.75,30.58) 19.23,32.11 v1(19.23,33.76)
$1N3037: length 82.9
  Top Layer w0.254: v1(19.99,58.9) v1(19.99,33) ; v1(21.39,20.93) 21.39,19.5 21.41,19.48 ; U2.3 v1(55.33,61.32)
  Bottom Layer w0.254: v1(21.39,20.93) 21.39,31.6 v1(19.99,33) ; v1(19.99,58.9) 20.06,58.98 32.64,58.98 33.35,59.69 34.24,59.69 34.85,60.3 43.48,60.3 44.24,59.54 46.15,59.54 46.53,59.92 55.33,59.92 v1(55.33,61.32)
$1N3048: length 105.7
  Top Layer w0.254: U1.3 78.66,66.28 v1(78.66,64.49) ; v1(23.29,21.44) 23.36,21.37 U6.12 ; v1(20.75,58.4) v1(20.75,33.76)
  Bottom Layer w0.254: v1(20.75,58.4) 32.94,58.4 33.88,59.34 34.49,59.34 35.1,59.94 43.34,59.94 44.1,59.18 46.3,59.18 46.6,59.49 78.27,59.49 v1(78.7,59.92) 78.7,64.45 v1(78.66,64.49) ; v1(23.29,21.44) 23.29,30.33 20.75,32.87 v1(20.75,33.76)
$1N3058: length 38.6
  Top Layer w0.254: U10.3 v1(11.52,38.58) ; v1(20.75,12.17) 20.76,12.18 U6.1
  Bottom Layer w0.254: v1(11.52,38.58) 11.52,35.79 12.75,35.79 12.75,28.55 17.45,28.55 17.45,12.17 v1(20.75,12.17)
$1N3068: length 41.2
  Top Layer w0.254: U9.3 v1(33.87,38.46) ; v1(23.42,12.17) 23.42,13.69 U6.5 ; v1(23.67,10.01) v1(25.32,10.01)
  Bottom Layer w0.254: v1(23.67,10.01) 23.67,11.91 v1(23.42,12.17) ; v1(25.32,10.01) 29.13,10.01 29.13,25.84 33.87,30.58 v1(33.87,38.46)
$1N3079: length 64.5
  Top Layer w0.254: v1(55.55,36.17) 55.55,39.74 U8.3 ; v1(21.41,9.37) 22.55,8.23 v1(25.32,8.23) ; 21.41,13.75 v1(21.41,12.68) ; v1(30.66,10.14) v1(30.66,8.36)
  Bottom Layer w0.254: v1(30.66,8.36) 25.45,8.36 v1(25.32,8.23) ; v1(21.41,9.37) v1(21.41,12.68) ; v1(30.66,10.14) 31.29,10.14 31.86,10.71 31.86,25.82 35.48,29.44 49.58,29.44 55.55,35.41 v1(55.55,36.17)
$1N3215: length 86.9
  Top Layer w0.254: U6.4 22.78,13.68 v1(22.78,12.68) ; v1(25.32,9.12) 23.29,9.12 v1(22.78,9.63) ; U7.3 v1(78.96,38.33)
  Bottom Layer w0.254: v1(25.32,9.12) 31.55,9.12 32.96,10.53 32.96,25.64 35.86,28.55 50.04,28.55 52.66,31.16 78.52,31.16 78.96,31.6 v1(78.96,38.33) ; v1(22.78,9.63) v1(22.78,12.68)
$1N3881: length 15.4
  Top Layer w0.254: U4.13 11.92,78.46 U11.1
$1N3886: length 12.1
  Top Layer w0.254: U11.2 11.22,75.92 11.22,72.1 U4.14
$1N3891: length 9
  Top Layer w0.254: U11.3 10.59,73.38 10.59,72.08 U4.15
$1N3896: length 14.8
  Top Layer w0.254: U4.12 v1(12.57,74.4) ; U11.4 5.13,70.84 v1(6.27,71.98) ; v1(6.27,74.4) v1(9.95,74.4)
  Bottom Layer w0.254: v1(9.95,74.4) v1(12.57,74.4) ; v1(6.27,71.98) v1(6.27,74.4)
$1N3906: length 12.9
  Top Layer w0.254: U11.6 4.88,63.86 v1(9.32,63.86) ; U4.5 v1(12.57,63.86)
  Bottom Layer w0.254: v1(9.32,63.86) v1(12.57,63.86)
$1N3911: length 10.7
  Top Layer w0.254: U11.7 10.62,63.22 U4.2
$1N3914: length 10.4
  Top Layer w0.254: U11.5 4.88,68.3 8.69,64.49 9.95,64.49 9.95,66.31 U4.1
$1N3928: length 14.6
  Top Layer w0.254: U4.4 11.92,60.68 U11.8
$1N3949: length 17.7
  Top Layer w0.254: U3.13 34.34,72.75 34.34,78.46 U12.1
$1N3954: length 14.6
  Top Layer w0.254: U3.14 33.7,72.73 33.7,75.92 U12.2
$1N3965: length 13
  Top Layer w0.254: U3.15 33.07,72.72 33.07,74.52 25.58,74.52 24.43,73.38 U12.3
$1N3970: length 18.1
  Top Layer w0.254: U12.4 27.99,70.84 v1(30.66,73.51) ; v1(30.66,75.29) v1(33.07,75.29) ; U3.12 v1(35.05,75.29)
  Bottom Layer w0.254: v1(30.66,73.51) v1(30.66,75.29) ; v1(33.07,75.29) v1(35.05,75.29)
$1N3975: length 10.6
  Top Layer w0.254: U3.1 32.39,66.9 31.04,66.9 29.64,68.3 U12.5
$1N3980: length 15.9
  Top Layer w0.254: U3.5 35.1,66.9 35.1,64.36 31.16,64.36 29.77,65.76 U12.6
$1N3985: length 14.1
  Top Layer w0.254: v1(33.07,63.73) 32.56,63.22 U12.7 ; U3.2 v1(33.09,65.51)
  Bottom Layer w0.254: v1(33.07,63.73) 33.09,63.76 v1(33.09,65.51)
$1N3996: length 17.6
  Top Layer w0.254: v1(34.34,62.97) 34.34,61.7 33.32,60.68 U12.8 ; U3.4 v1(34.39,65.38)
  Bottom Layer w0.254: v1(34.34,62.97) 34.39,63.02 v1(34.39,65.38)
$1N4043: length 17.1
  Top Layer w0.254: U13.1 55.93,78.46 55.93,72.24 U2.13
$1N4047: length 13.9
  Top Layer w0.254: U2.14 55.33,75.92 U13.2
$1N4051: length 10.7
  Top Layer w0.254: U2.15 54.66,72.21 54.66,73.38 U13.3
$1N4055: length 17.4
  Top Layer w0.254: 56.64,72.18 56.69,72.24 v1(56.69,74.4) ; v1(52.12,72.62) 52.12,70.84 U13.4 ; v1(52.12,74.4) v1(54.66,74.4)
  Bottom Layer w0.254: v1(52.12,74.4) v1(52.12,72.62) ; v1(56.69,74.4) v1(54.66,74.4)
$1N4059: length 14.2
  Top Layer w0.254: U13.5 49.58,68.3 49.58,64.75 54.02,64.75 54.02,66.44 54.04,66.45
$1N4064: length 14.8
  Top Layer w0.254: U13.6 47.55,65.76 49.33,63.98 v1(53.77,63.98) ; v1(56.69,63.98) 56.69,66.4 56.64,66.45
  Bottom Layer w0.254: v1(56.69,63.98) v1(53.77,63.98)
$1N4078: length 12.8
  Top Layer w0.254: U13.7 54.68,63.22 U2.2
$1N4086: length 16.7
  Top Layer w0.254: U13.8 56.06,60.68 56.06,66.38 U2.4
$1N4111: length 18.7
  Top Layer w0.254: U14.1 79.3,78.46 79.3,72.11 79.35,72.06
$1N4115: length 15.6
  Top Layer w0.254: U14.2 78.66,75.92 78.66,72.1 U1.14
$1N4119: length 12.4
  Top Layer w0.254: U1.15 78.03,72.08 78.03,73.38 U14.3
$1N4123: length 18.4
  Top Layer w0.254: U14.4 76.12,70.84 v1(76.12,72.62) ; U1.12 79.93,72.13 v1(79.93,74.14) ; v1(76.12,74.14) v1(77.9,74.14)
  Bottom Layer w0.254: v1(79.93,74.14) v1(77.9,74.14) ; v1(76.12,74.14) v1(76.12,72.62)
$1N4127: length 15.3
  Top Layer w0.254: U14.5 70.15,68.3 74.98,63.48 77.39,63.48 77.39,66.31 U1.1
$1N4132: length 18.3
  Top Layer w0.254: U1.5 80.06,66.27 80.06,62.46 74.47,62.46 71.17,65.76 U14.6
$1N4137: length 17
  Top Layer w0.254: U1.2 v1(78.05,63.48) ; U14.7 72.06,63.22 74.09,61.19 78.03,61.19 v1(78.03,61.82)
  Bottom Layer w0.254: v1(78.05,63.48) 78.03,63.45 v1(78.03,61.82)
$1N4145: length 18.1
  Top Layer w0.254: 79.35,66.32 v1(79.35,63.22) ; U14.8 79.42,60.68 v1(79.42,61.57)
  Bottom Layer w0.254: v1(79.35,63.22) 79.42,63.15 v1(79.42,61.57)
$1N4177: length 14.8
  Top Layer w0.254: U10.13 12.11,45.7 12.11,51.28 11.61,51.79 U15.1
$1N4181: length 11.9
  Top Layer w0.254: 3.22,49.25 11.48,49.25 11.48,45.68 U10.14
$1N4185: length 9.6
  Top Layer w0.254: U15.3 5.13,46.71 5.76,47.35 10.84,47.35 10.84,45.67 U10.15
$1N4189: length 15.9
  Top Layer w0.254: v1(8.81,46.58) 8.81,45.19 7.8,44.17 U15.4 ; U10.12 v1(12.82,48.36) ; v1(8.81,48.36) v1(10.59,48.36)
  Bottom Layer w0.254: v1(10.59,48.36) v1(12.82,48.36) ; v1(8.81,46.58) v1(8.81,48.36)
$1N4193: length 10.1
  Top Layer w0.254: U10.1 10.21,39.9 10.21,38.2 8.56,38.2 5.13,41.63 U15.5
$1N4204: length 13.2
  Top Layer w0.254: U10.5 12.88,39.85 12.88,37.19 7.03,37.19 5.13,39.09 U15.6
$1N4225: length 11
  Top Layer w0.254: U10.2 v1(10.87,38.08) ; U15.7 v1(10.84,36.55)
  Bottom Layer w0.254: v1(10.84,36.55) 10.87,36.58 v1(10.87,38.08)
$1N4228: length 14.9
  Top Layer w0.254: U10.4 12.24,39.84 v1(12.24,38.2) ; U15.8 12.24,34.01 v1(12.24,36.42)
  Bottom Layer w0.254: v1(12.24,36.42) v1(12.24,38.2)
$1N4281: length 18
  Top Layer w0.254: U9.13 34.47,45.7 34.47,51.79 U16.1
$1N4285: length 14.8
  Top Layer w0.254: 22.65,49.25 33.83,49.25 33.83,45.68 U9.14
$1N4289: length 12
  Top Layer w0.254: U9.15 33.2,45.67 33.2,46.97 22.91,46.97 U16.3
$1N4293: length 17.3
  Top Layer w0.254: v1(31.04,47.73) v1(33.2,47.73) ; v1(35.17,47.73) U9.12 ; v1(31.04,46.2) 31.04,45.7 29.51,44.17 U16.4
  Bottom Layer w0.254: v1(33.2,47.73) v1(35.17,47.73) ; v1(31.04,46.2) v1(31.04,47.73)
$1N4297: length 13.8
  Top Layer w0.254: U9.1 32.56,39.9 32.56,37.69 28.62,37.69 24.69,41.63 U16.5
$1N4302: length 16
  Top Layer w0.254: U16.6 25.83,39.09 27.73,37.19 35.1,37.19 35.1,39.84 U9.5
$1N4307: length 13.9
  Top Layer w0.254: U16.7 v1(33.2,36.55) ; U9.2 33.2,39.88 v1(33.2,37.82)
  Bottom Layer w0.254: v1(33.2,36.55) v1(33.2,37.82)
$1N4310: length 17.7
  Top Layer w0.254: v1(34.47,37.82) 34.47,39.85 U9.4 ; v1(34.47,36.55) 34.47,34.01 U16.8
  Bottom Layer w0.254: v1(34.47,36.55) v1(34.47,37.82)
$1N4317: length 17.1
  Top Layer w0.254: U8.13 56.18,45.57 56.18,51.79 U17.1
$1N4321: length 13.9
  Top Layer w0.254: 45.39,49.25 55.55,49.25 55.55,45.55 U8.14
$1N4325: length 10.7
  Top Layer w0.254: U17.3 54.91,46.71 54.91,45.54 U8.15
$1N4333: length 18.8
  Top Layer w0.254: U7.13 79.68,45.58 79.68,51.79 U18.1
$1N4337: length 15.4
  Top Layer w0.254: 67.23,49.25 78.92,49.25 78.92,45.55 U7.14
$1N4341: length 12.3
  Top Layer w0.254: U18.3 78.28,46.71 78.28,45.54 U7.15
$1N4345: length 17
  Top Layer w0.254: U18.4 74.47,44.17 v1(76.38,46.08) ; U7.12 80.31,45.57 v1(80.31,47.35) ; v1(76.38,47.35) v1(78.15,47.35)
  Bottom Layer w0.254: v1(76.38,47.35) v1(76.38,46.08) ; v1(80.31,47.35) v1(78.15,47.35)
$1N4349: length 11.7
  Top Layer w0.254: U8.1 54.28,39.77 54.28,38.33 50.34,38.33 47.04,41.63 U17.5
$1N4373: length 14.6
  Top Layer w0.254: U8.5 56.95,39.73 v1(56.95,37.44) ; v1(54.28,37.44) 49.45,37.44 47.8,39.09 U17.6
  Bottom Layer w0.254: v1(54.28,37.44) v1(56.95,37.44)
$1N4379: length 12.8
  Top Layer w0.254: U8.2 54.91,39.76 54.91,36.55 U17.7
$1N4380: length 15.9
  Top Layer w0.254: U8.12 56.95,45.57 v1(56.95,47.47) ; v1(53.01,45.7) 51.48,44.17 U17.4 ; v1(53.01,47.47) v1(54.91,47.47)
  Bottom Layer w0.254: v1(56.95,47.47) v1(54.91,47.47) ; v1(53.01,47.47) v1(53.01,45.7)
$1N4389: length 16.7
  Top Layer w0.254: U8.4 56.18,39.73 56.18,33.88 45.39,33.88
$1N4396: length 14.1
  Top Layer w0.254: U7.1 77.65,39.77 77.65,37.69 76.5,37.69 72.57,41.63 U18.5
$1N4401: length 17
  Top Layer w0.254: U7.5 80.31,39.73 80.31,36.81 76.38,36.81 74.09,39.09 U18.6
$1N4406: length 15.5
  Top Layer w0.254: v1(78.28,37.57) 78.28,39.76 U7.2 ; U18.7 75.23,36.55 76.12,35.66 v1(78.28,35.66)
  Bottom Layer w0.254: v1(78.28,35.66) v1(78.28,37.57)
$1N4409: length 18.1
  Top Layer w0.254: v1(79.55,35.66) 79.55,34.01 U18.8 ; U7.4 79.61,39.77 v1(79.61,37.57)
  Bottom Layer w0.254: v1(79.55,35.66) 79.61,35.73 v1(79.61,37.57)

## Text on the board
Top Silkscreen Layer: SIG | A5 | A2 | A1 | A6 | A4 | A3 | VSS (V-) | GRND | VCC (V+) | OUT1 | OUT8 | OUT33 | OUT40 | OUT48 | OUT16 | OUT41 | OUT9 | OUT24 | OUT49 | OUT56 | OUT17 | OUT25 | OUT32 | OUT57 | OUT64
